# EAGLE design SwdAdapter (EAGLE 9.1.3)
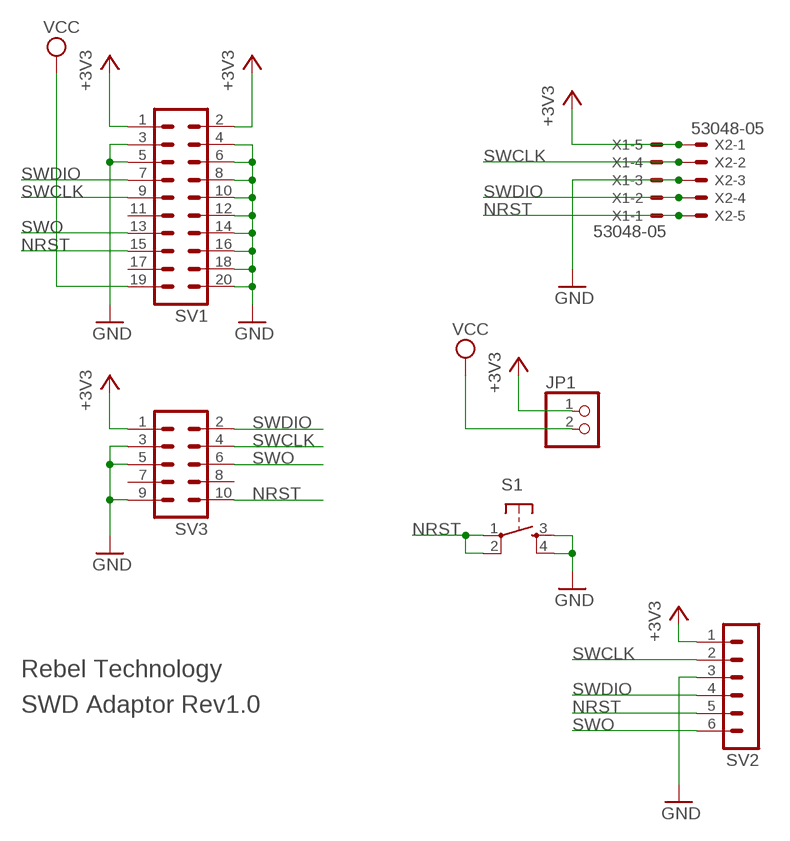
[diagram p0: schematic, sheet 1]

## Parts
JP1  PINHD-1X2  [1X02]
S1  TAC_SWITCHPTH  [TACTILE-PTH]
SV1  MA10-2  [MA10-2]
SV2  MA06-1  [MA06-1]
SV3  MA05-2  [MA05-2]
X1  53048-05  [53048-05]
X2  53048-05  [53048-05]

## Nets
+3V3: JP1.1 SV1.1 SV1.2 SV2.1 SV3.1 X1.5 X2.1
GND: S1.3 S1.4 SV1.3 SV1.4 SV1.5 SV1.6 SV1.8 SV1.10 SV1.12 SV1.14 SV1.16 SV1.18 SV1.20 SV2.3 SV3.3 SV3.5 SV3.9 X1.3 X2.3
NRST: S1.1 S1.2 SV1.15 SV2.5 SV3.10 X1.1 X2.5
SWCLK: SV1.9 SV2.2 SV3.4 X1.4 X2.2
SWDIO: SV1.7 SV2.4 SV3.2 X1.2 X2.4
SWO: SV1.13 SV2.6 SV3.6
VCC: JP1.2 SV1.19
Unconnected: SV1.11 SV1.17 SV3.7 SV3.8

## Notes on the sheet
- Rebel Technology
- SWD Adaptor Rev1.0

## Library data of the parts
JP1 = pinhead:PINHD-1X2: PIN HEADER
S1 = SparkFun:TAC_SWITCH: Momentary Switch Button commonly used for reset or general input. Spark Fun Electronics SKU : COM-00097
SV1 = con-lstb:MA10-2: PIN HEADER; OC_FARNELL: unknown; OC_NEWARK: unknown
SV2 = con-lstb:MA06-1: PIN HEADER; OC_FARNELL: unknown; OC_NEWARK: unknown
SV3 = con-lstb:MA05-2: PIN HEADER; OC_FARNELL: unknown; OC_NEWARK: unknown
X1 X2 = con-molex:53?-05: CONNECTOR wire to board 1.25 mm (.049 inch) pitch header; MF: MOLEX; MPN: 53048-0510; OC_FARNELL: 9732926; OC_NEWARK: 57H4722

## Net classes
1 power: width 0.178 mm, drill 0.305 mm, clearance 0.178 mm to class 0, clearance 0.178 mm

## Board
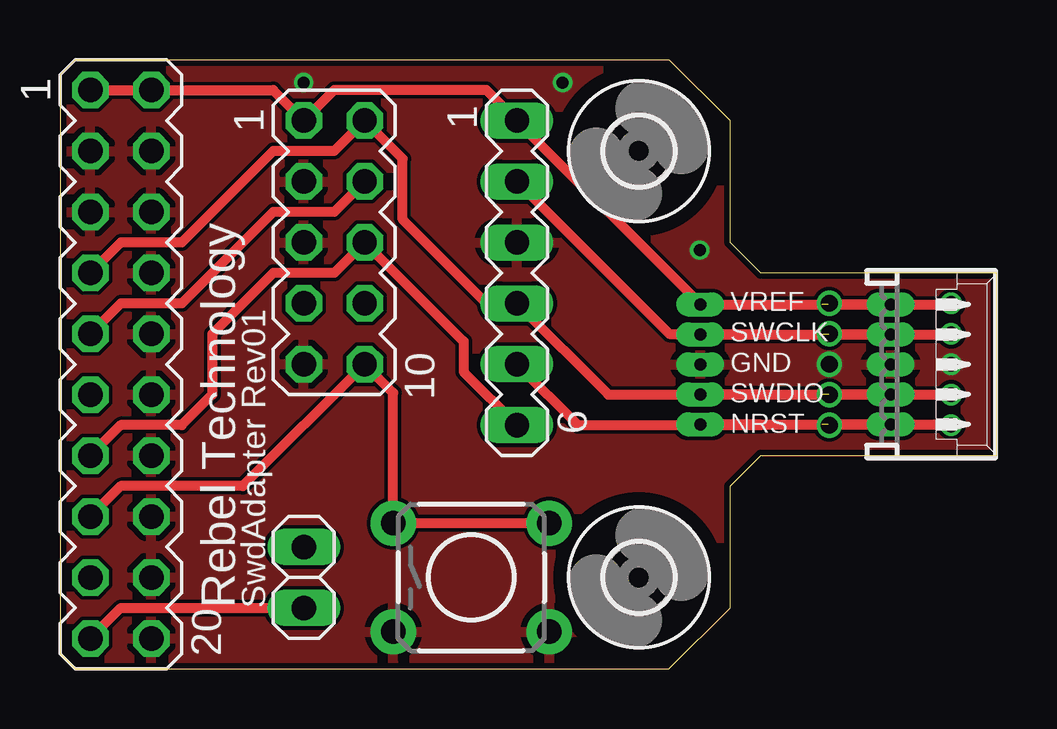
[diagram p1: board, top side]
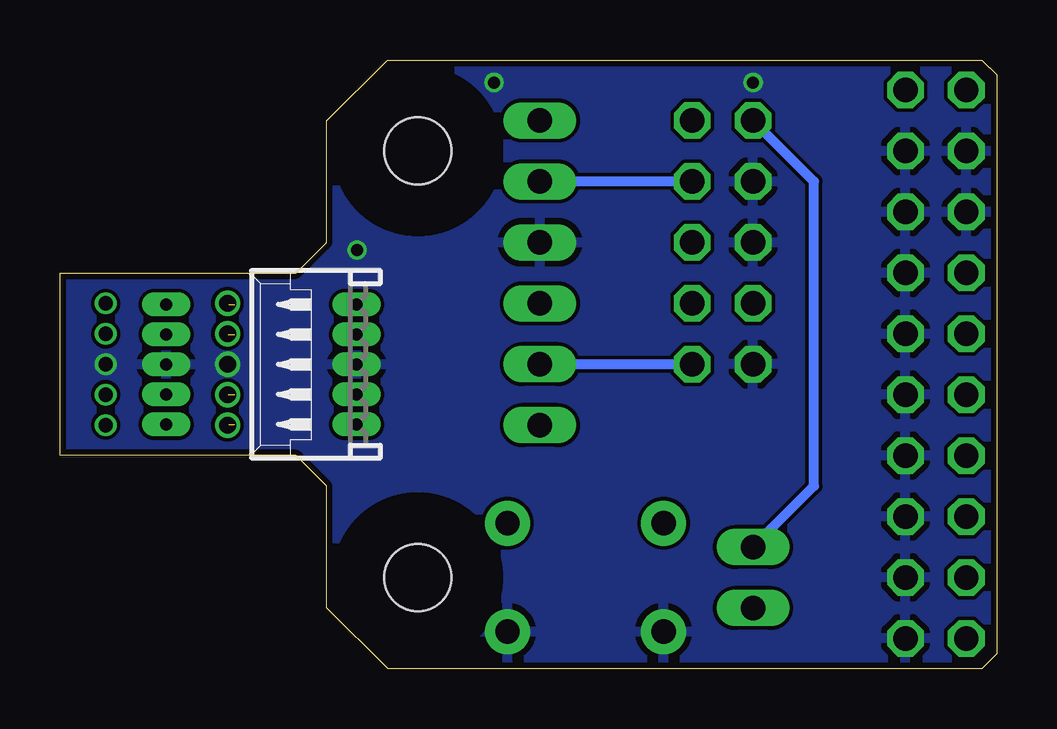
[diagram p2: board, bottom side, seen from below]

Size 39.05 x 25.39 mm. Coordinates in mm from the lower left corner, seen from the top.
Outline: 0.64,0 25.38,0 27.94,2.54 27.94,7.62 29.21,8.89 39.05,8.89 39.05,16.51 29.21,16.51 27.94,17.78 27.94,22.85 25.4,25.39 0.62,25.39 0,24.77 0,0.64 0.64,0
Copper layers (1*16): Top 0.035mm / dielectric 1.5mm / Bottom 0.035mm
Design rules "SeeedStudio_2layer_DRU_no_angle_20140221": minimum track width 6mil, minimum drill 12mil, track to track 6mil, track to pad 6mil, pad to pad 6mil, via to via 6mil, smd to smd 0mil, copper to edge 10mil, drill to drill 10mil, minimum pad ring 10mil, minimum via ring 6mil, stop-mask expansion 2mil, vias tented up to drill 100mil, thermal gap 10mil

### Footprints (pad centres in the part's own frame; a part is rotated, then mirrored left to right if it is on the bottom)
1X02 = drill 1.016 long: 1 -1.27,0; 2 1.27,0
TACTILE-PTH = drill 1.016 pad 1.88: 1 -3.251,2.261; 2 3.251,2.261; 3 -3.251,-2.261; 4 3.251,-2.261
MA10-2 = drill 1.016 octagon: 1 -11.43,-1.27; 2 -11.43,1.27; 3 -8.89,-1.27; 4 -8.89,1.27; 5 -6.35,-1.27; 6 -6.35,1.27; 7 -3.81,-1.27; 8 -3.81,1.27; 9 -1.27,-1.27; 10 -1.27,1.27; 11 1.27,-1.27; 12 1.27,1.27; 13 3.81,-1.27; 14 3.81,1.27; 15 6.35,-1.27; 16 6.35,1.27; 17 8.89,-1.27; 18 8.89,1.27; 19 11.43,-1.27; 20 11.43,1.27
MA06-1 = drill 1.016 long: 1 -6.35,0; 2 -3.81,0; 3 -1.27,0; 4 1.27,0; 5 3.81,0; 6 6.35,0
MA05-2 = drill 1.016 octagon: 1 -5.08,-1.27; 2 -5.08,1.27; 3 -2.54,-1.27; 4 -2.54,1.27; 5 0,-1.27; 6 0,1.27; 7 2.54,-1.27; 8 2.54,1.27; 9 5.08,-1.27; 10 5.08,1.27
2,8 = hole 2.8: 0,0
53048-05 = drill 0.5 pad 0.698 long: 1 2.5,-1.25; 2 1.25,-1.25; 3 0,-1.25; 4 -1.25,-1.25; 5 -2.5,-1.25

### Placement (x,y rotation side)
JP1  10.16,3.81 270 top
S1  17.14,3.81 0 top
SV1  2.54,12.7 270 top
SV2  19.05,16.51 270 top
SV3  11.43,17.78 270 top
U$1  [2,8]  24.13,3.81 0 top
U$5  [2,8]  24.13,21.59 0 top
X1  35.88,12.7 270 top
X2  27.94,12.7 90 bottom

### Tracks (layer width: path | path; a pad name or v marks a point on that pad's centre or on a via)
+3V3  (via drill 0.6, 0.7)  (1 unrouted)
  Top 0.406: SV1.1 SV1.2 8.89,24.13 SV3.1 11.43,24.13 17.78,24.13 SV2.1 19.03,22.86 26.67,15.24 26.71,15.2 X2.1 32.03,15.2 v32.07,15.24 32.11,15.2 X1.5 | 31.77,15.2 37.11,15.2 v37.15,15.24 37.19,15.2
  Bottom 0.406: JP1.1 7.62,7.62 7.62,20.32 SV3.1
GND  (via drill 0.5, 0.6, 0.7)
  other vias: 32.07,12.7 10.16,24.45 20.95,24.45 26.67,17.46 37.15,12.7
  pour Bottom: -2.54,30.48 44.45,30.48 44.45,-2.54 -2.54,-2.54
  pour Top: -3.81,29.21 43.18,29.21 43.18,-3.81 -3.81,-3.81
NRST  (via drill 0.6, 0.7)  (1 unrouted)
  Top 0.406: SV1.15 2.54,7.62 7.62,7.62 SV3.10 13.89,11.51 S1.1 S1.2 | X1.1 32.11,10.2 v32.07,10.16 32.03,10.2 X2.5 29.21,10.18 29.21,10.16 21.59,10.16 SV2.5 | 31.77,10.2 37.11,10.2 v37.15,10.16 37.19,10.2
  Bottom 0.406: SV3.10 SV2.5
SWCLK  (via drill 0.6, 0.7)  (1 unrouted)
  Top 0.406: SV3.4 11.43,19.05 8.89,19.05 5.08,15.24 2.54,15.24 SV1.9 | SV2.2 25.4,13.97 29.21,13.97 X2.2 32.05,13.95 v32.07,13.97 32.09,13.95 X1.4 | 31.77,13.95 37.13,13.95 v37.15,13.97 37.17,13.95
  Bottom 0.406: SV3.4 SV2.2
SWDIO  (via drill 0.6, 0.7)  (1 unrouted)
  Top 0.406: SV1.7 2.54,17.78 5.08,17.78 8.89,21.59 11.43,21.59 SV3.2 14.29,21.27 14.29,18.73 17.78,15.24 SV2.4 22.86,11.43 29.21,11.43 X2.4 32.05,11.45 v32.07,11.43 32.09,11.45 X1.2 | 31.77,11.45 37.13,11.45 v37.15,11.43 37.17,11.45
SWO
  Top 0.406: SV1.13 2.54,10.16 5.08,10.16 6.35,11.43 6.35,13.97 8.89,16.51 11.43,16.51 SV3.6 16.83,13.65 16.83,12.38 SV2.6
VCC
  Top 0.406: SV1.19 2.54,2.54 JP1.2

### Text on the board
tPlace: VREF | SWCLK | GND | SWDIO | NRST | Rebel Technology | SwdAdapter Rev01